# EAGLE schematic technologies (EAGLE 6.6.0)
Assembly variants: 4 PARTS, 8 PARTS, 8 PARTS ALT
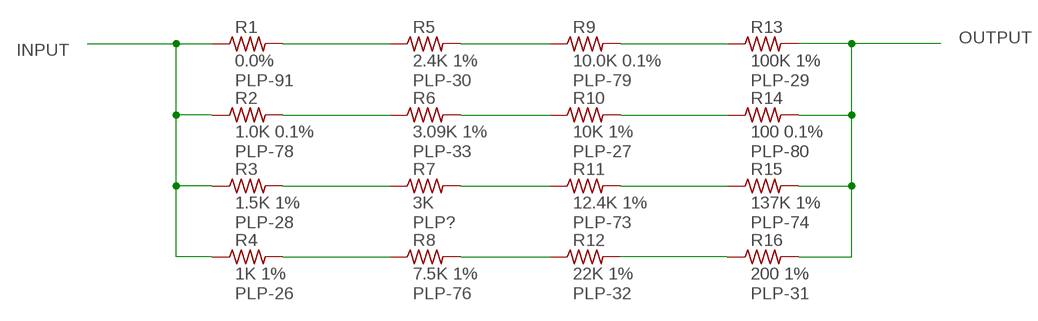
[diagram p0: schematic, sheet 1]

## Parts
R1  0.0%  RES-6030.0OHM  [DISCRETE_R0603]  (not fitted in variant 8 PARTS ALT)
R2  1.0K 0.1%  RES-6031.0K0.1%  [DISCRETE_R0603]  (not fitted in variant 4 PARTS)  (not fitted in variant 8 PARTS)
R3  1.5K 1%  RES-6031.5K1%  [DISCRETE_R0603]  (not fitted in variant 4 PARTS)  (not fitted in variant 8 PARTS ALT)
R4  1K 1%  RES-6031K1%  [DISCRETE_R0603]  (not fitted in variant 4 PARTS)  (not fitted in variant 8 PARTS)
R5  2.4K 1%  RES-6032.4K1%  [DISCRETE_R0603]  (not fitted in variant 8 PARTS ALT)
R6  3.09K 1%  RES-6033.09K1%  [DISCRETE_R0603]  (not fitted in variant 4 PARTS)  (not fitted in variant 8 PARTS)
R7  3K  RES-6033K5%  [DISCRETE_R0603]  (not fitted in variant 4 PARTS)  (not fitted in variant 8 PARTS ALT)
R8  7.5K 1%  RES-6037.5K1%  [DISCRETE_R0603]  (not fitted in variant 4 PARTS)  (not fitted in variant 8 PARTS)
R9  10.0K 0.1%  RES-60310.0K0.1%  [DISCRETE_R0603]  (not fitted in variant 8 PARTS ALT)
R10  10K 1%  RES-60310K1%  [DISCRETE_R0603]  (not fitted in variant 4 PARTS)  (not fitted in variant 8 PARTS)
R11  12.4K 1%  RES-60312.4K1%  [DISCRETE_R0603]  (not fitted in variant 4 PARTS)  (not fitted in variant 8 PARTS ALT)
R12  22K 1%  RES-60322K1%  [DISCRETE_R0603]  (not fitted in variant 4 PARTS)  (not fitted in variant 8 PARTS)
R13  100K 1%  RES-603100K1%  [DISCRETE_R0603]  (not fitted in variant 8 PARTS ALT)
R14  100 0.1%  RES-603100OHM0.1%  [DISCRETE_R0603]  (not fitted in variant 4 PARTS)  (not fitted in variant 8 PARTS)
R15  137K 1%  RES-603137K1%  [DISCRETE_R0603]  (not fitted in variant 4 PARTS)  (not fitted in variant 8 PARTS ALT)
R16  200 1%  RES-603200OHM1%  [DISCRETE_R0603]  (not fitted in variant 4 PARTS)  (not fitted in variant 8 PARTS)

## Nets
INPUT: R1.1 R2.1 R3.1 R4.1
N$2: R1.2 R5.1
N$3: R2.2 R6.1
N$4: R3.2 R7.1
N$5: R4.2 R8.1
N$6: R8.2 R12.1
N$7: R7.2 R11.1
N$8: R6.2 R10.1
N$9: R5.2 R9.1
N$10: R9.2 R13.1
N$12: R10.2 R14.1
N$13: R11.2 R15.1
N$14: R12.2 R16.1
OUTPUT: R13.2 R14.2 R15.2 R16.2

## Library data of the parts
R1 = PLP:RES-603; PLP#: PLP-91
R2 = PLP:RES-603; PLP#: PLP-78
R3 = PLP:RES-603; PLP#: PLP-28
R4 = PLP:RES-603; PLP#: PLP-26
R5 = PLP:RES-603; PLP#: PLP-30
R6 = PLP:RES-603; PLP#: PLP-33
R7 = PLP:RES-603; PLP#: PLP?
R8 = PLP:RES-603; PLP#: PLP-76
R9 = PLP:RES-603; PLP#: PLP-79
R10 = PLP:RES-603; PLP#: PLP-27
R11 = PLP:RES-603; PLP#: PLP-73
R12 = PLP:RES-603; PLP#: PLP-32
R13 = PLP:RES-603; PLP#: PLP-29
R14 = PLP:RES-603; PLP#: PLP-80
R15 = PLP:RES-603; PLP#: PLP-74
R16 = PLP:RES-603; PLP#: PLP-31